# EAGLE design Backplane (EAGLE 7.6.0)
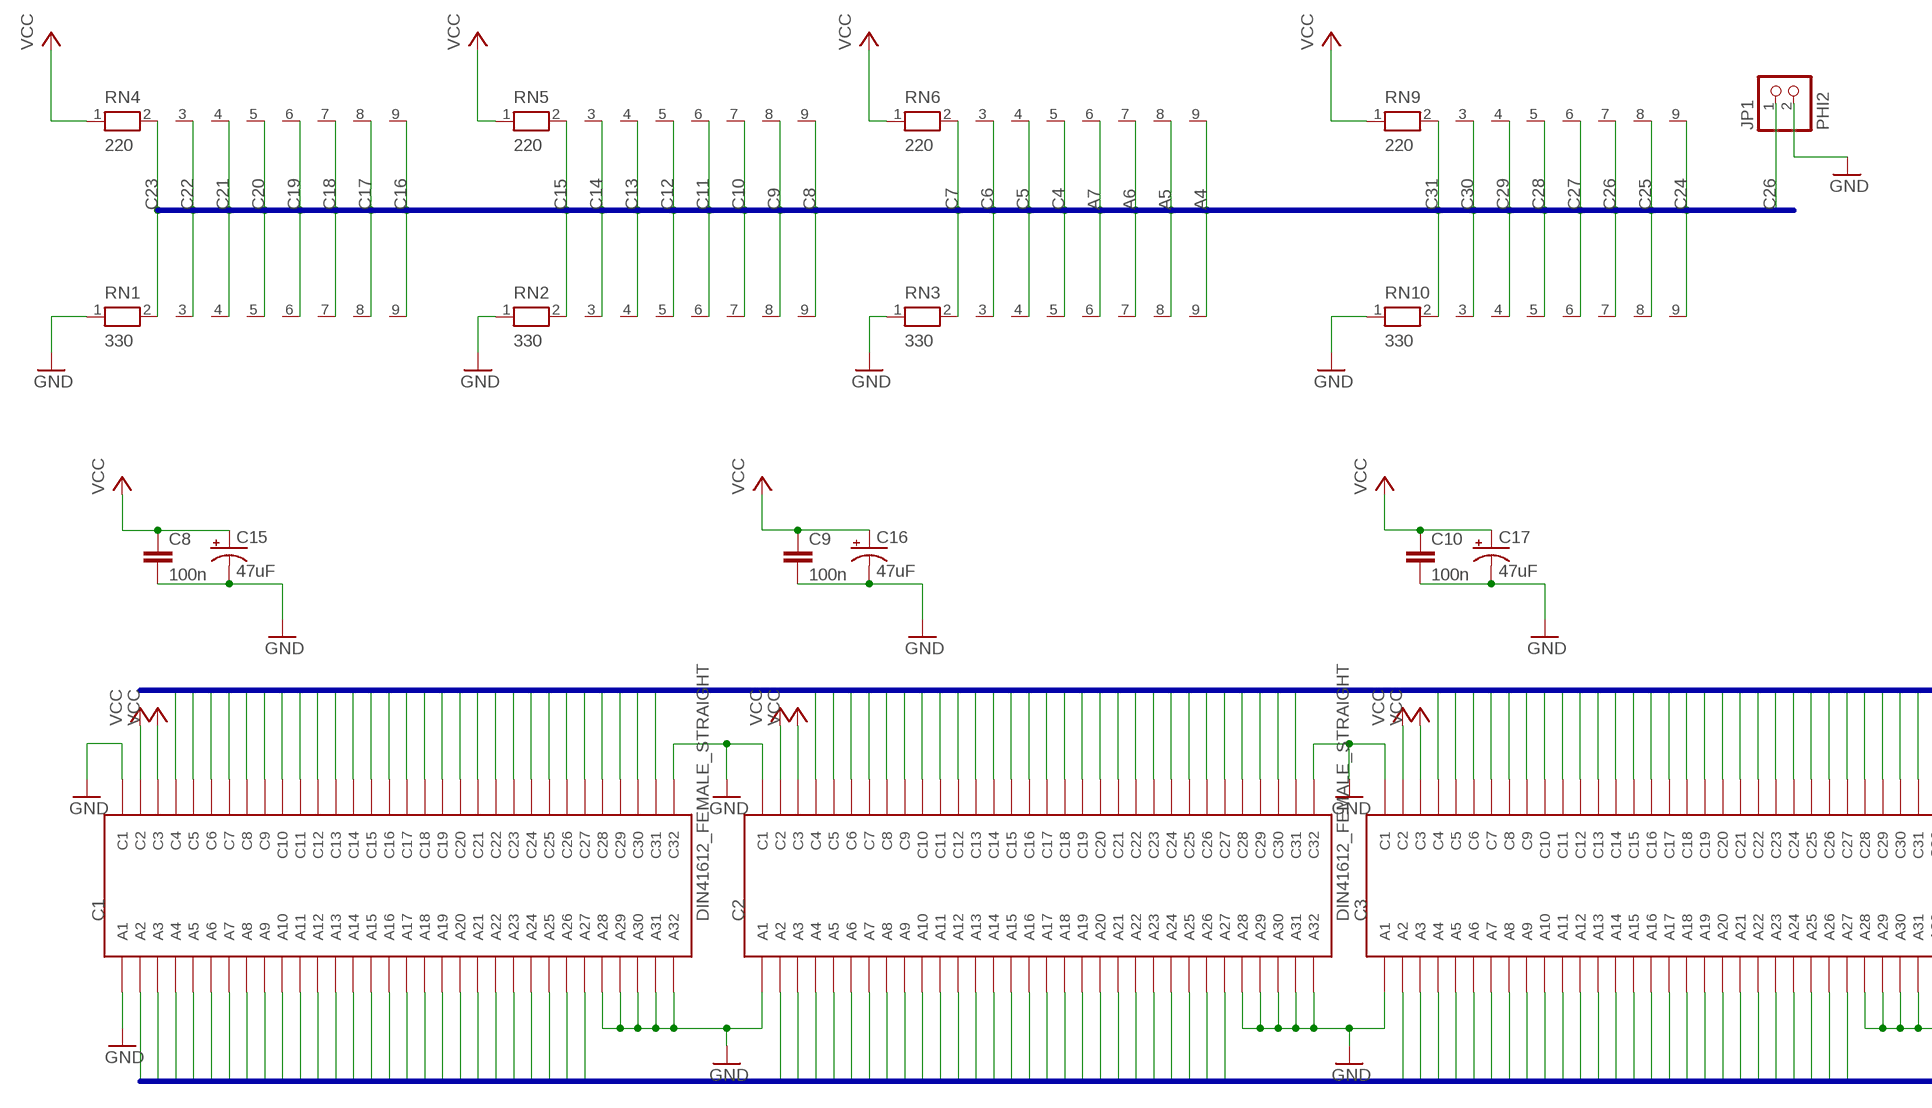
[diagram p0: schematic, sheet 1, part 1 of 2]
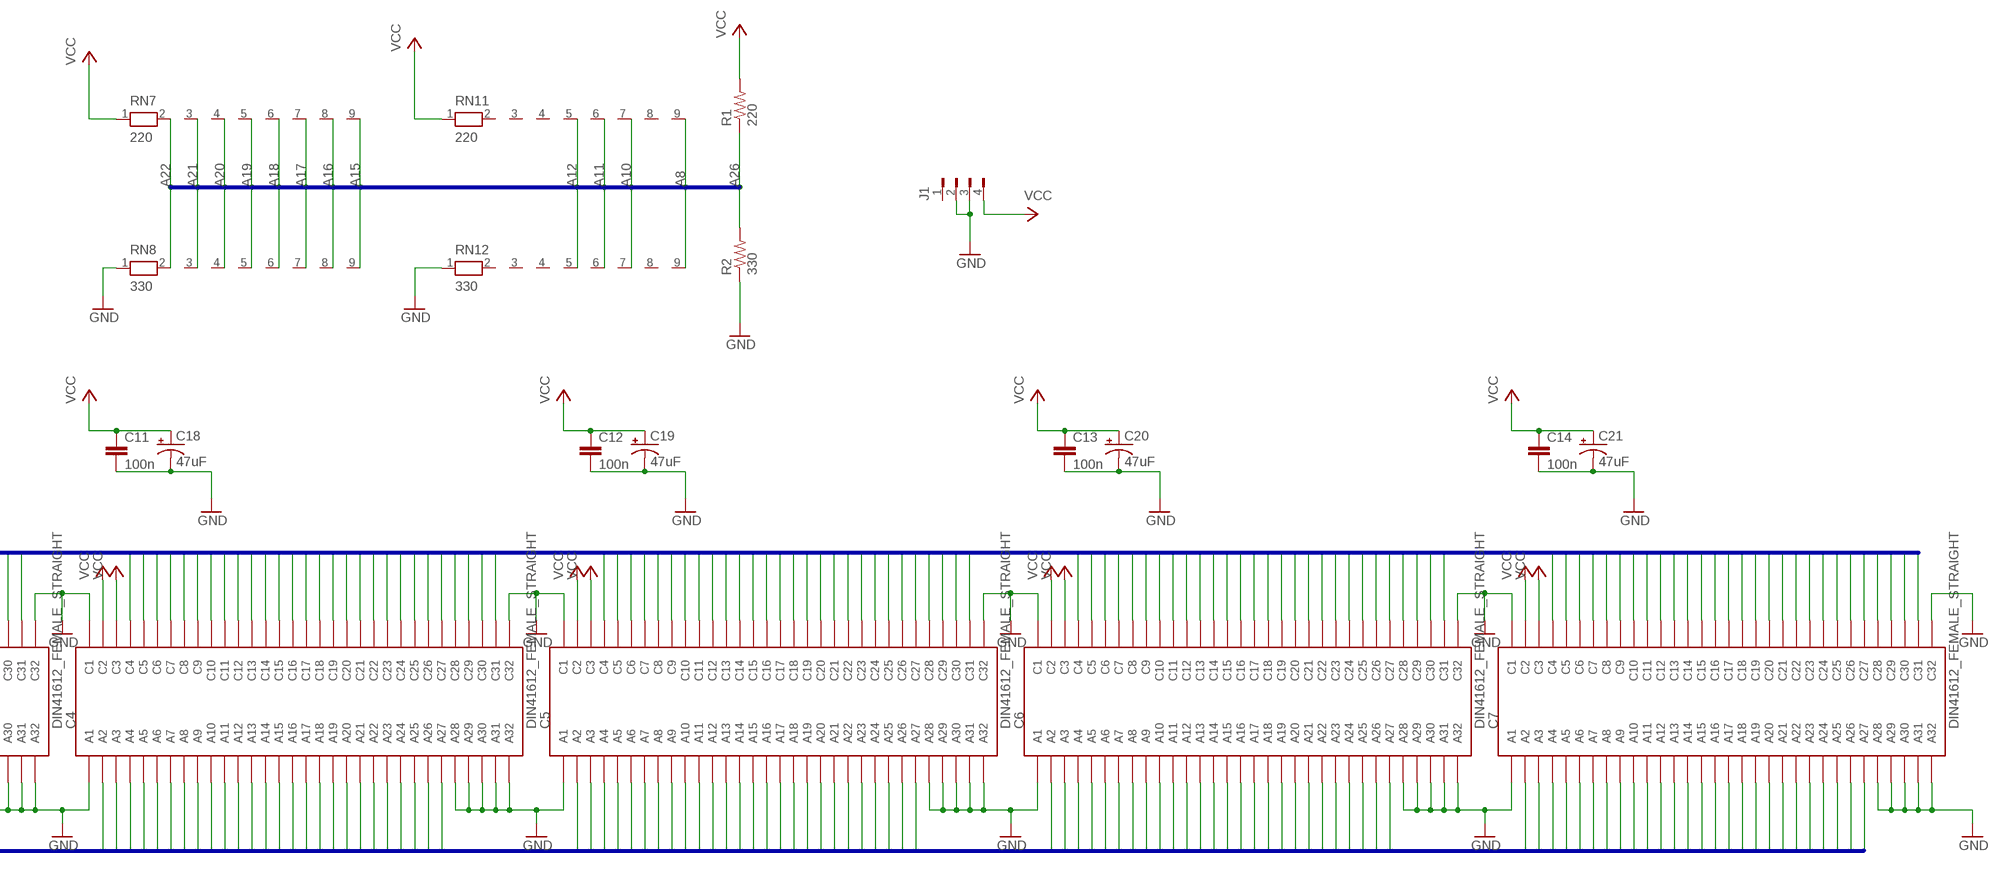
[diagram p1: schematic, sheet 1, part 2 of 2]

## Parts
C1  DIN41612_FEMALE_STRAIGHT  [DIN41612_FEMALE_STRAIGHT]
C2  DIN41612_FEMALE_STRAIGHT  [DIN41612_FEMALE_STRAIGHT]
C3  DIN41612_FEMALE_STRAIGHT  [DIN41612_FEMALE_STRAIGHT]
C4  DIN41612_FEMALE_STRAIGHT  [DIN41612_FEMALE_STRAIGHT]
C5  DIN41612_FEMALE_STRAIGHT  [DIN41612_FEMALE_STRAIGHT]
C6  DIN41612_FEMALE_STRAIGHT  [DIN41612_FEMALE_STRAIGHT]
C7  DIN41612_FEMALE_STRAIGHT  [DIN41612_FEMALE_STRAIGHT]
C8  100n  C-EU025-025X050  [C025-025X050]
C9  100n  C-EU025-025X050  [C025-025X050]
C10  100n  C-EU025-025X050  [C025-025X050]
C11  100n  C-EU025-025X050  [C025-025X050]
C12  100n  C-EU025-025X050  [C025-025X050]
C13  100n  C-EU025-025X050  [C025-025X050]
C14  100n  C-EU025-025X050  [C025-025X050]
C15  47uF  CPOL-USE2.5-7  [E2,5-7]
C16  47uF  CPOL-USE2.5-7  [E2,5-7]
C17  47uF  CPOL-USE2.5-7  [E2,5-7]
C18  47uF  CPOL-USE2.5-7  [E2,5-7]
C19  47uF  CPOL-USE2.5-7  [E2,5-7]
C20  47uF  CPOL-USE2.5-7  [E2,5-7]
C21  47uF  CPOL-USE2.5-7  [E2,5-7]
J1  FLOPPY-4350211  [350211]
JP1  PHI2  PINHD-1X2  [1X02]
R1  220  R-US_0204/5  [0204/5]
R2  330  R-US_0204/5  [0204/5]
RN1  330  RN08  [RN-9]
RN2  330  RN08  [RN-9]
RN3  330  RN08  [RN-9]
RN4  220  RN08  [RN-9]
RN5  220  RN08  [RN-9]
RN6  220  RN08  [RN-9]
RN7  220  RN08  [RN-9]
RN8  330  RN08  [RN-9]
RN9  220  RN08  [RN-9]
RN10  330  RN08  [RN-9]
RN11  220  RN08  [RN-9]
RN12  330  RN08  [RN-9]

## Nets
A2: C1.A2 C2.A2 C3.A2 C4.A2 C5.A2 C6.A2 C7.A2
A3: C1.A3 C2.A3 C3.A3 C4.A3 C5.A3 C6.A3 C7.A3
A4: C1.A4 C2.A4 C3.A4 C4.A4 C5.A4 C6.A4 C7.A4 RN3.9 RN6.9
A5: C1.A5 C2.A5 C3.A5 C4.A5 C5.A5 C6.A5 C7.A5 RN3.8 RN6.8
A6: C1.A6 C2.A6 C3.A6 C4.A6 C5.A6 C6.A6 C7.A6 RN3.7 RN6.7
A7: C1.A7 C2.A7 C3.A7 C4.A7 C5.A7 C6.A7 C7.A7 RN3.6 RN6.6
A8: C1.A8 C2.A8 C3.A8 C4.A8 C5.A8 C6.A8 C7.A8 RN11.9 RN12.9
A9: C1.A9 C2.A9 C3.A9 C4.A9 C5.A9 C6.A9 C7.A9
A10: C1.A10 C2.A10 C3.A10 C4.A10 C5.A10 C6.A10 C7.A10 RN11.7 RN12.7
A11: C1.A11 C2.A11 C3.A11 C4.A11 C5.A11 C6.A11 C7.A11 RN11.6 RN12.6
A12: C1.A12 C2.A12 C3.A12 C4.A12 C5.A12 C6.A12 C7.A12 RN11.5 RN12.5
A13: C1.A13 C2.A13 C3.A13 C4.A13 C5.A13 C6.A13 C7.A13
A14: C1.A14 C2.A14 C3.A14 C4.A14 C5.A14 C6.A14 C7.A14
A15: C1.A15 C2.A15 C3.A15 C4.A15 C5.A15 C6.A15 C7.A15 RN7.9 RN8.9
A16: C1.A16 C2.A16 C3.A16 C4.A16 C5.A16 C6.A16 C7.A16 RN7.8 RN8.8
A17: C1.A17 C2.A17 C3.A17 C4.A17 C5.A17 C6.A17 C7.A17 RN7.7 RN8.7
A18: C1.A18 C2.A18 C3.A18 C4.A18 C5.A18 C6.A18 C7.A18 RN7.6 RN8.6
A19: C1.A19 C2.A19 C3.A19 C4.A19 C5.A19 C6.A19 C7.A19 RN7.5 RN8.5
A20: C1.A20 C2.A20 C3.A20 C4.A20 C5.A20 C6.A20 C7.A20 RN7.4 RN8.4
A21: C1.A21 C2.A21 C3.A21 C4.A21 C5.A21 C6.A21 C7.A21 RN7.3 RN8.3
A22: C1.A22 C2.A22 C3.A22 C4.A22 C5.A22 C6.A22 C7.A22 RN7.2 RN8.2
A23: C1.A23 C2.A23 C3.A23 C4.A23 C5.A23 C6.A23 C7.A23
A24: C1.A24 C2.A24 C3.A24 C4.A24 C5.A24 C6.A24 C7.A24
A25: C1.A25 C2.A25 C3.A25 C4.A25 C5.A25 C6.A25 C7.A25
A26: C1.A26 C2.A26 C3.A26 C4.A26 C5.A26 C6.A26 C7.A26 R1.1 R2.2
A27: C1.A27 C2.A27 C3.A27 C4.A27 C5.A27 C6.A27 C7.A27
C4: C1.C4 C2.C4 C3.C4 C4.C4 C5.C4 C6.C4 C7.C4 RN3.5 RN6.5
C5: C1.C5 C2.C5 C3.C5 C4.C5 C5.C5 C6.C5 C7.C5 RN3.4 RN6.4
C6: C1.C6 C2.C6 C3.C6 C4.C6 C5.C6 C6.C6 C7.C6 RN3.3 RN6.3
C7: C1.C7 C2.C7 C3.C7 C4.C7 C5.C7 C6.C7 C7.C7 RN3.2 RN6.2
C8: C1.C8 C2.C8 C3.C8 C4.C8 C5.C8 C6.C8 C7.C8 RN2.9 RN5.9
C9: C1.C9 C2.C9 C3.C9 C4.C9 C5.C9 C6.C9 C7.C9 RN2.8 RN5.8
C10: C1.C10 C2.C10 C3.C10 C4.C10 C5.C10 C6.C10 C7.C10 RN2.7 RN5.7
C11: C1.C11 C2.C11 C3.C11 C4.C11 C5.C11 C6.C11 C7.C11 RN2.6 RN5.6
C12: C1.C12 C2.C12 C3.C12 C4.C12 C5.C12 C6.C12 C7.C12 RN2.5 RN5.5
C13: C1.C13 C2.C13 C3.C13 C4.C13 C5.C13 C6.C13 C7.C13 RN2.4 RN5.4
C14: C1.C14 C2.C14 C3.C14 C4.C14 C5.C14 C6.C14 C7.C14 RN2.3 RN5.3
C15: C1.C15 C2.C15 C3.C15 C4.C15 C5.C15 C6.C15 C7.C15 RN2.2 RN5.2
C16: C1.C16 C2.C16 C3.C16 C4.C16 C5.C16 C6.C16 C7.C16 RN1.9 RN4.9
C17: C1.C17 C2.C17 C3.C17 C4.C17 C5.C17 C6.C17 C7.C17 RN1.8 RN4.8
C18: C1.C18 C2.C18 C3.C18 C4.C18 C5.C18 C6.C18 C7.C18 RN1.7 RN4.7
C19: C1.C19 C2.C19 C3.C19 C4.C19 C5.C19 C6.C19 C7.C19 RN1.6 RN4.6
C20: C1.C20 C2.C20 C3.C20 C4.C20 C5.C20 C6.C20 C7.C20 RN1.5 RN4.5
C21: C1.C21 C2.C21 C3.C21 C4.C21 C5.C21 C6.C21 C7.C21 RN1.4 RN4.4
C22: C1.C22 C2.C22 C3.C22 C4.C22 C5.C22 C6.C22 C7.C22 RN1.3 RN4.3
C23: C1.C23 C2.C23 C3.C23 C4.C23 C5.C23 C6.C23 C7.C23 RN1.2 RN4.2
C24: C1.C24 C2.C24 C3.C24 C4.C24 C5.C24 C6.C24 C7.C24 RN9.9 RN10.9
C25: C1.C25 C2.C25 C3.C25 C4.C25 C5.C25 C6.C25 C7.C25 RN9.8 RN10.8
C26: C1.C26 C2.C26 C3.C26 C4.C26 C5.C26 C6.C26 C7.C26 JP1.1 RN9.7 RN10.7
C27: C1.C27 C2.C27 C3.C27 C4.C27 C5.C27 C6.C27 C7.C27 RN9.6 RN10.6
C28: C1.C28 C2.C28 C3.C28 C4.C28 C5.C28 C6.C28 C7.C28 RN9.5 RN10.5
C29: C1.C29 C2.C29 C3.C29 C4.C29 C5.C29 C6.C29 C7.C29 RN9.4 RN10.4
C30: C1.C30 C2.C30 C3.C30 C4.C30 C5.C30 C6.C30 C7.C30 RN9.3 RN10.3
C31: C1.C31 C2.C31 C3.C31 C4.C31 C5.C31 C6.C31 C7.C31 RN9.2 RN10.2
GND: C1.A1 C1.A28 C1.A29 C1.A30 C1.A31 C1.A32 C1.C1 C1.C32 C2.A1 C2.A28 C2.A29 C2.A30 C2.A31 C2.A32 C2.C1 C2.C32 C3.A1 C3.A28 C3.A29 C3.A30 C3.A31 C3.A32 C3.C1 C3.C32 C4.A1 C4.A28 C4.A29 C4.A30 C4.A31 C4.A32 C4.C1 C4.C32 C5.A1 C5.A28 C5.A29 C5.A30 C5.A31 C5.A32 C5.C1 C5.C32 C6.A1 C6.A28 C6.A29 C6.A30 C6.A31 C6.A32 C6.C1 C6.C32 C7.A1 C7.A28 C7.A29 C7.A30 C7.A31 C7.A32 C7.C1 C7.C32 C8.2 C9.2 C10.2 C11.2 C12.2 C13.2 C14.2 C15.- C16.- C17.- C18.- C19.- C20.- C21.- J1.2 J1.3 JP1.2 R2.1 RN1.1 RN2.1 RN3.1 RN8.1 RN10.1 RN12.1
VCC: C1.C2 C1.C3 C2.C2 C2.C3 C3.C2 C3.C3 C4.C2 C4.C3 C5.C2 C5.C3 C6.C2 C6.C3 C7.C2 C7.C3 C8.1 C9.1 C10.1 C11.1 C12.1 C13.1 C14.1 C15.+ C16.+ C17.+ C18.+ C19.+ C20.+ C21.+ J1.4 R1.2 RN4.1 RN5.1 RN6.1 RN7.1 RN9.1 RN11.1
Unconnected: J1.1 RN11.2 RN11.3 RN11.4 RN11.8 RN12.2 RN12.3 RN12.4 RN12.8

## Buses
A[1..32]
C[1..32]

## Library data of the parts
C1-C7 = DIN41612:DIN41612_FEMALE_STRAIGHT
C8-C14 = rcl:C-EU: CAPACITOR, European symbol
C15-C21 = rcl:CPOL-US: POLARIZED CAPACITOR, American symbol
J1 = con-amp:FLOPPY-4: MATE N-LOCK Floppy / HDD conector Distributor: Bürklin 71F970
JP1 = pinhead:PINHD-1X2: PIN HEADER
R1 R2 = rcl:R-US_: RESISTOR, American symbol
RN1-RN12 = resistor-net:RN08: RESISTOR NETWORK; OC_FARNELL: unknown; OC_NEWARK: unknown

## Board
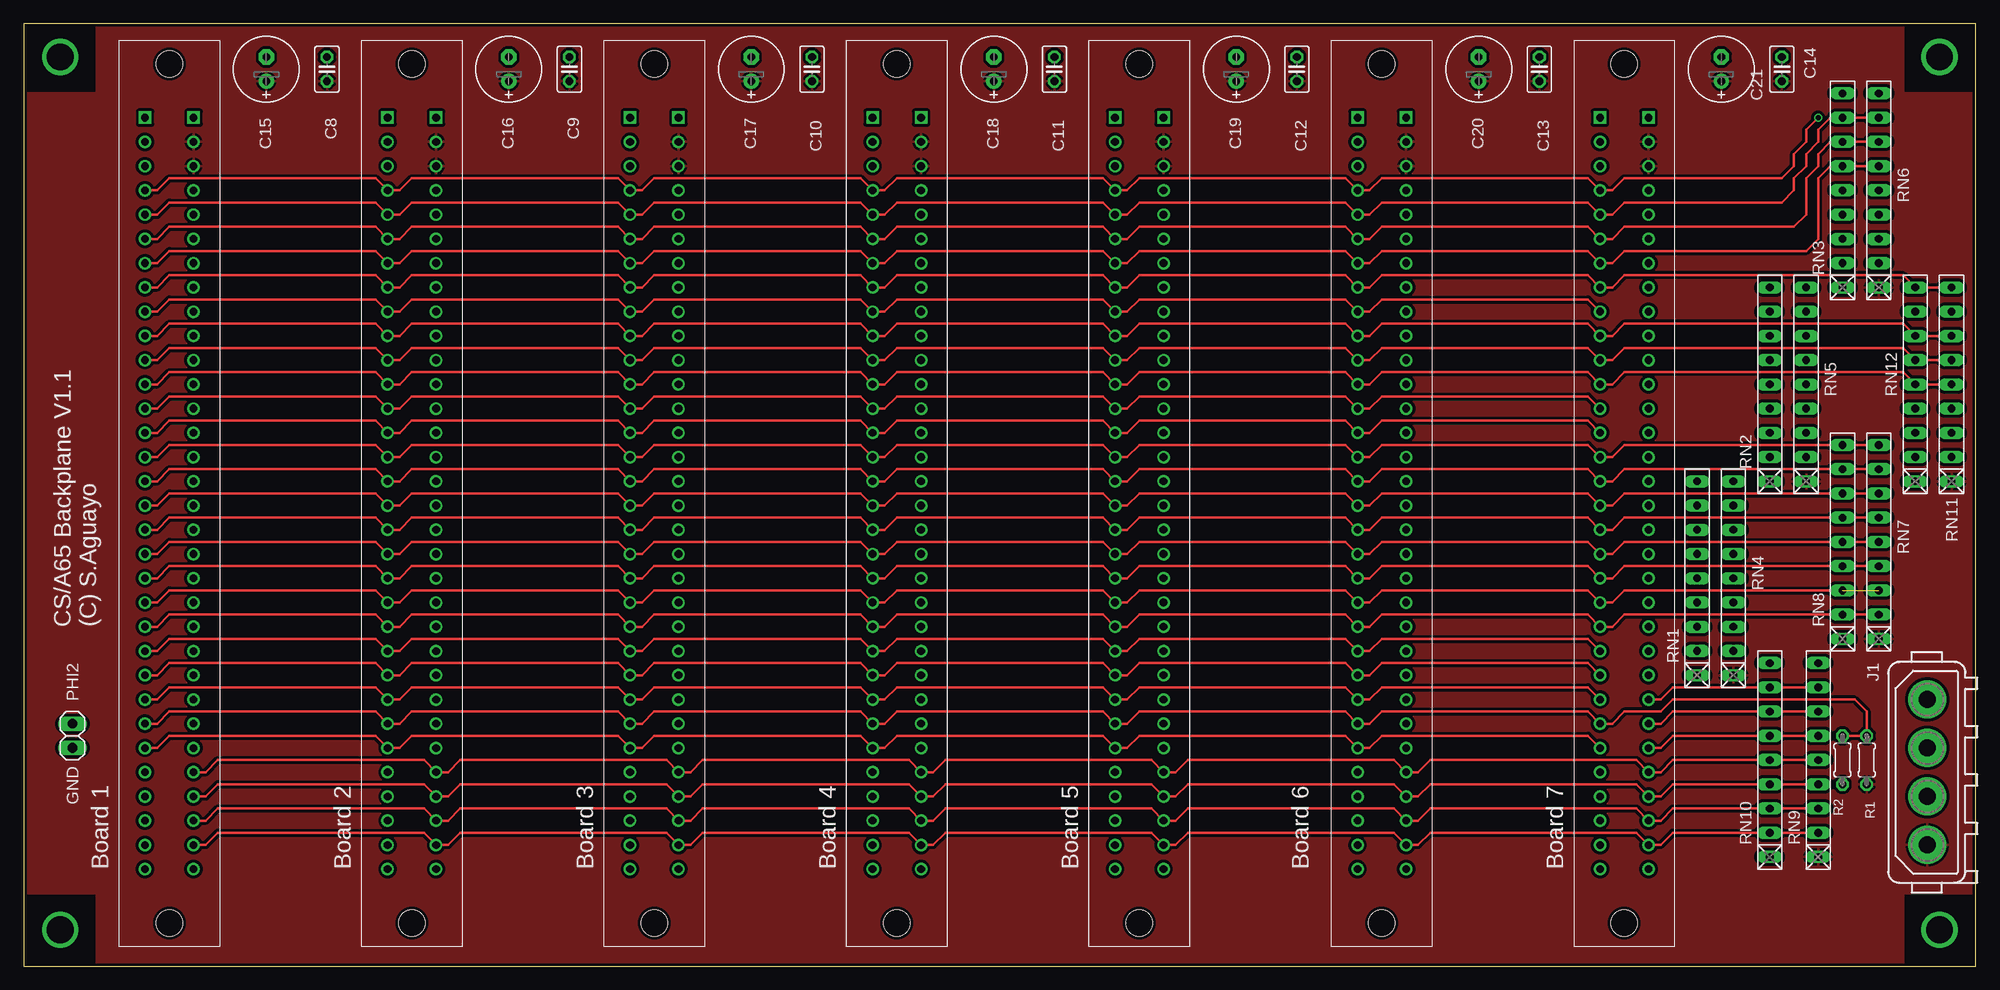
[diagram p2: board, top side]
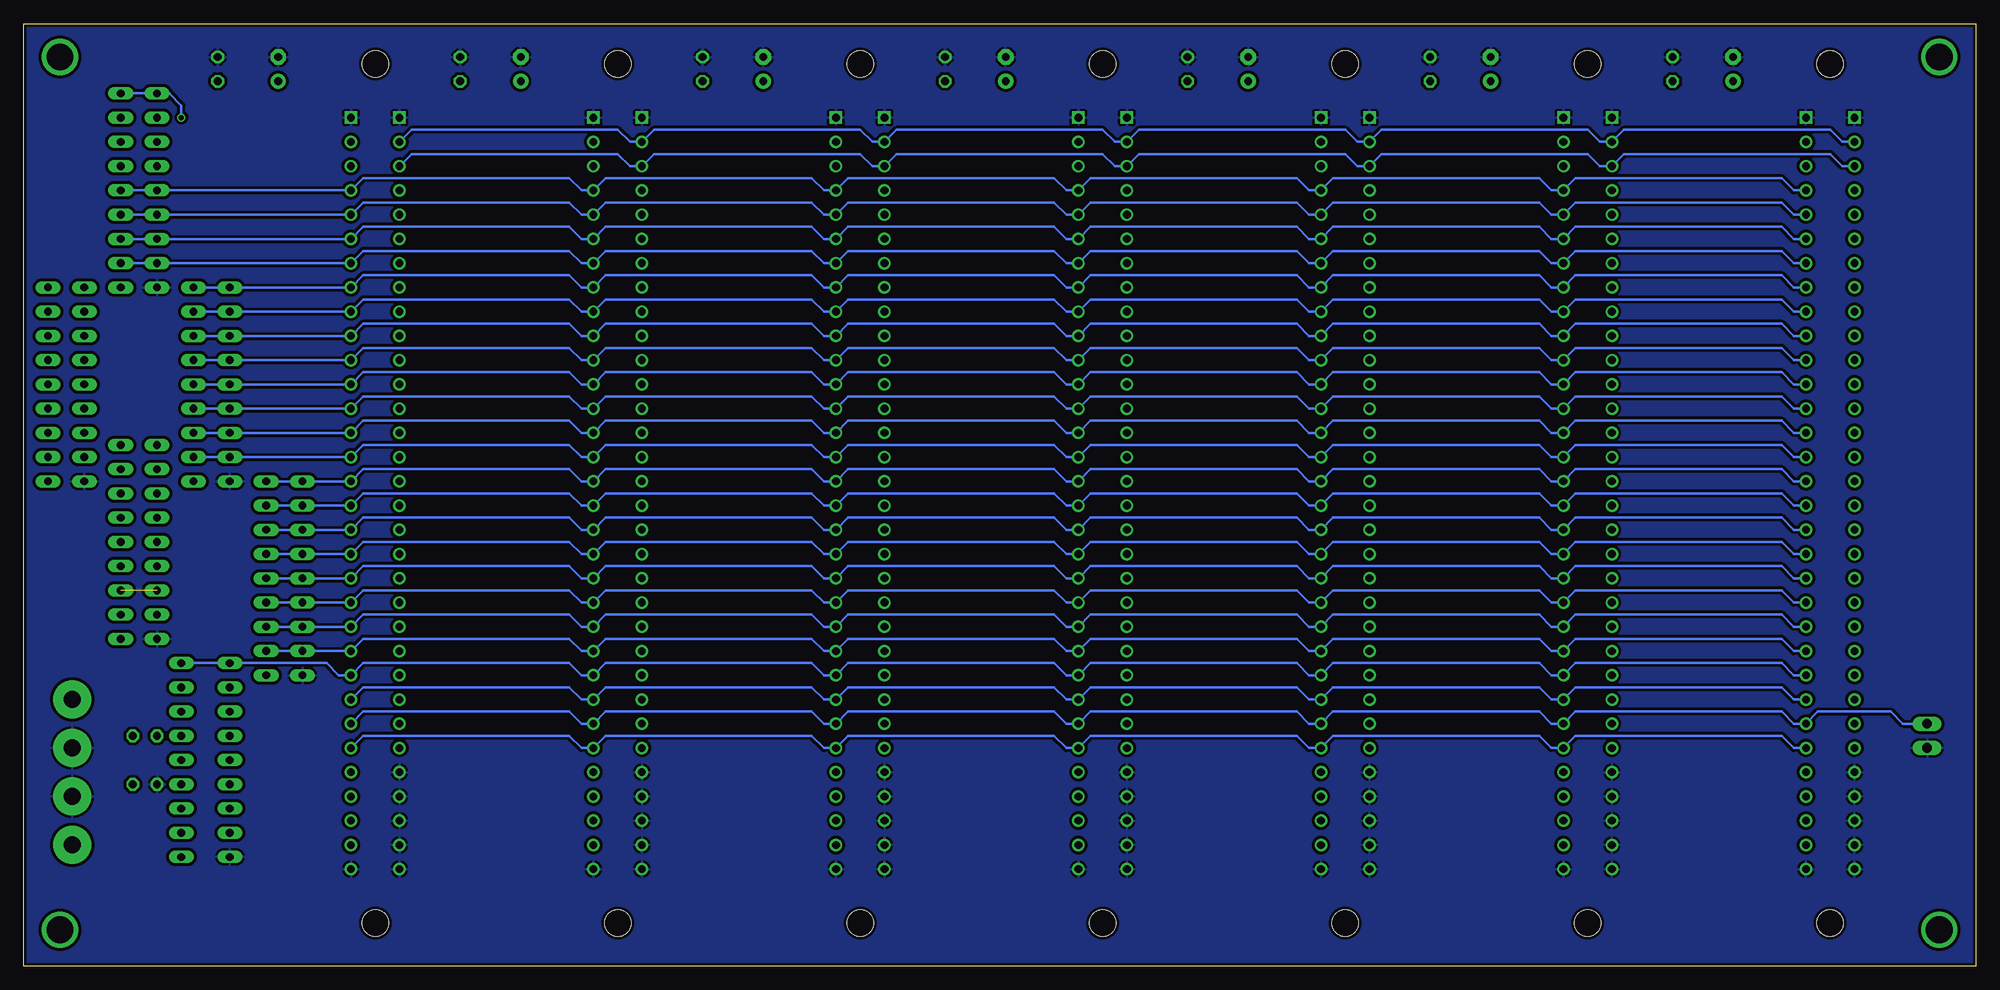
[diagram p3: board, bottom side, seen from below]

Size 204.45 x 98.73 mm. Coordinates in mm from the lower left corner, seen from the top.
Outline: 0,0 204.45,0 204.45,98.73 0,98.73 0,0
Copper layers (1*16): Top 0.035mm / dielectric 1.5mm / Bottom 0.035mm
Design rules "SeeedStudio_2layer_DRU_no_angle_20140221": minimum track width 6mil, minimum drill 12mil, track to track 6mil, track to pad 6mil, pad to pad 6mil, via to via 6mil, smd to smd 0mil, copper to edge 10mil, drill to drill 10mil, minimum pad ring 10mil, minimum via ring 6mil, stop-mask expansion 2mil, vias tented up to drill 100mil, thermal gap 10mil

### Footprints (pad centres in the part's own frame; a part is rotated, then mirrored left to right if it is on the bottom)
DIN41612_FEMALE_STRAIGHT = drill 0.8 square: A1 39.37,2.54; C1 39.37,-2.54 | drill 0.8: A2 36.83,2.54; A3 34.29,2.54; A4 31.75,2.54; A5 29.21,2.54; A6 26.67,2.54; A7 24.13,2.54; A8 21.59,2.54; A9 19.05,2.54; A10 16.51,2.54; A11 13.97,2.54; A12 11.43,2.54; A13 8.89,2.54; A14 6.35,2.54; A15 3.81,2.54; A16 1.27,2.54; A17 -1.27,2.54; A18 -3.81,2.54; A19 -6.35,2.54; A20 -8.89,2.54; A21 -11.43,2.54; A22 -13.97,2.54; A23 -16.51,2.54; A24 -19.05,2.54; A25 -21.59,2.54; A26 -24.13,2.54; A27 -26.67,2.54; A28 -29.21,2.54; A29 -31.75,2.54; A30 -34.29,2.54; A31 -36.83,2.54; A32 -39.37,2.54; C2 36.83,-2.54; C3 34.29,-2.54; C4 31.75,-2.54; C5 29.21,-2.54; C6 26.67,-2.54; C7 24.13,-2.54; C8 21.59,-2.54; C9 19.05,-2.54; C10 16.51,-2.54; C11 13.97,-2.54; C12 11.43,-2.54; C13 8.89,-2.54; C14 6.35,-2.54; C15 3.81,-2.54; C16 1.27,-2.54; C17 -1.27,-2.54; C18 -3.81,-2.54; C19 -6.35,-2.54; C20 -8.89,-2.54; C21 -11.43,-2.54; C22 -13.97,-2.54; C23 -16.51,-2.54; C24 -19.05,-2.54; C25 -21.59,-2.54; C26 -24.13,-2.54; C27 -26.67,-2.54; C28 -29.21,-2.54; C29 -31.75,-2.54; C30 -34.29,-2.54; C31 -36.83,-2.54; C32 -39.37,-2.54 | hole 2.8: -45,0; 45,0
C025-025X050 = drill 0.813 octagon: 1 -1.27,0; 2 1.27,0
E2,5-7 = drill 0.813 pad 1.6: + -1.27,0 | drill 0.813 pad 1.6 octagon: - 1.27,0
350211 = drill 1.8 pad 4: 1 -7.62,0; 2 -2.54,0; 3 2.54,0; 4 7.62,0
1X02 = drill 1.016 long: 1 -1.27,0; 2 1.27,0
0204/5 = drill 0.813 octagon: 1 -2.54,0; 2 2.54,0
RN-9 = drill 0.813 long: 1 -10.16,0; 2 -7.62,0; 3 -5.08,0; 4 -2.54,0; 5 0,0; 6 2.54,0; 7 5.08,0; 8 7.62,0; 9 10.16,0

### Placement (x,y rotation side)
C1  15.24,49.53 90 top
C2  40.64,49.53 90 top
C3  66.04,49.53 90 top
C4  91.44,49.53 90 top
C5  116.84,49.53 90 top
C6  142.24,49.53 90 top
C7  167.64,49.53 90 top
C8  31.75,93.98 90 top
C9  57.15,93.98 90 top
C10  82.55,93.98 90 top
C11  107.95,93.98 90 top
C12  133.35,93.98 90 top
C13  158.75,93.98 90 top
C14  184.15,93.98 90 top
C15  25.4,93.98 90 top
C16  50.8,93.98 90 top
C17  76.2,93.98 90 top
C18  101.6,93.98 90 top
C19  127,93.98 90 top
C20  152.4,93.98 90 top
C21  177.8,93.98 90 top
J1  199.39,20.32 270 top
JP1  5.08,24.13 270 top
R1  193.04,21.59 270 top
R2  190.5,21.59 90 top
RN1  175.26,40.64 90 top
RN2  182.88,60.96 90 top
RN3  190.5,81.28 90 top
RN4  179.07,40.64 90 top
RN5  186.69,60.96 90 top
RN6  194.31,81.28 90 top
RN7  194.31,44.45 90 top
RN8  190.5,44.45 90 top
RN9  187.96,21.59 90 top
RN10  182.88,21.59 90 top
RN11  201.93,60.96 90 top
RN12  198.12,60.96 90 top

### Tracks (layer width: path | path; a pad name or v marks a point on that pad's centre or on a via)
A2
  Bottom 0.254: C1.A2 13.97,86.36 15.24,87.63 36.83,87.63 C2.A2 39.37,86.36 40.64,87.63 62.23,87.63 C3.A2 64.77,86.36 66.04,87.63 87.63,87.63 C4.A2 90.17,86.36 91.44,87.63 113.03,87.63 C5.A2 115.57,86.36 116.84,87.63 138.43,87.63 C6.A2 140.97,86.36 142.24,87.63 163.83,87.63 C7.A2
A3
  Bottom 0.254: C1.A3 13.97,83.82 15.24,85.09 36.83,85.09 C2.A3 39.37,83.82 40.64,85.09 62.23,85.09 C3.A3 64.77,83.82 66.04,85.09 87.63,85.09 C4.A3 90.17,83.82 91.44,85.09 113.03,85.09 C5.A3 115.57,83.82 116.84,85.09 138.43,85.09 C6.A3 140.97,83.82 142.24,85.09 163.83,85.09 C7.A3
A4  (via drill 0.5)
  Top 0.254: C1.A4 13.97,81.28 15.24,82.55 36.83,82.55 C2.A4 39.37,81.28 40.64,82.55 62.23,82.55 C3.A4 64.77,81.28 66.04,82.55 87.63,82.55 C4.A4 90.17,81.28 91.44,82.55 113.03,82.55 C5.A4 115.57,81.28 116.84,82.55 138.43,82.55 C6.A4 140.97,81.28 142.24,82.55 163.83,82.55 C7.A4 166.37,81.28 167.64,82.55 184.15,82.55 185.42,83.82 185.42,85.09 186.69,86.36 186.69,87.63 v187.96,88.9
  Bottom 0.254: v187.96,88.9 187.96,90.17 189.23,91.44 RN3.9 RN6.9
A5
  Top 0.254: C1.A5 13.97,78.74 15.24,80.01 36.83,80.01 C2.A5 39.37,78.74 40.64,80.01 62.23,80.01 C3.A5 64.77,78.74 66.04,80.01 87.63,80.01 C4.A5 90.17,78.74 91.44,80.01 113.03,80.01 C5.A5 115.57,78.74 116.84,80.01 138.43,80.01 C6.A5 140.97,78.74 142.24,80.01 163.83,80.01 C7.A5 166.37,78.74 167.64,80.01 184.15,80.01 185.42,81.28 185.42,82.55 186.69,83.82 186.69,85.09 187.96,86.36 187.96,87.63 189.23,88.9 RN3.8 RN6.8
A6
  Top 0.254: C1.A6 13.97,76.2 15.24,77.47 36.83,77.47 C2.A6 39.37,76.2 40.64,77.47 62.23,77.47 C3.A6 64.77,76.2 66.04,77.47 87.63,77.47 C4.A6 90.17,76.2 91.44,77.47 113.03,77.47 C5.A6 115.57,76.2 116.84,77.47 138.43,77.47 C6.A6 140.97,76.2 142.24,77.47 163.83,77.47 C7.A6 166.37,76.2 167.64,77.47 185.42,77.47 186.69,78.74 186.69,82.55 187.96,83.82 187.96,85.09 189.23,86.36 RN3.7 RN6.7
A7
  Top 0.254: C1.A7 13.97,73.66 15.24,74.93 36.83,74.93 C2.A7 39.37,73.66 40.64,74.93 62.23,74.93 C3.A7 64.77,73.66 66.04,74.93 87.63,74.93 C4.A7 90.17,73.66 91.44,74.93 113.03,74.93 C5.A7 115.57,73.66 116.84,74.93 138.43,74.93 C6.A7 140.97,73.66 142.24,74.93 163.83,74.93 C7.A7 166.37,73.66 167.64,74.93 186.69,74.93 187.96,76.2 187.96,82.55 189.23,83.82 RN3.6 RN6.6
A8
  Top 0.254: C1.A8 13.97,71.12 15.24,72.39 36.83,72.39 C2.A8 39.37,71.12 40.64,72.39 62.23,72.39 C3.A8 64.77,71.12 66.04,72.39 87.63,72.39 C4.A8 90.17,71.12 91.44,72.39 113.03,72.39 C5.A8 115.57,71.12 116.84,72.39 138.43,72.39 C6.A8 140.97,71.12 142.24,72.39 163.83,72.39 C7.A8 166.37,71.12 167.64,72.39 196.85,72.39 RN12.9 RN11.9
A9
  Top 0.254: C1.A9 13.97,68.58 15.24,69.85 36.83,69.85 C2.A9 39.37,68.58 40.64,69.85 62.23,69.85 C3.A9 64.77,68.58 66.04,69.85 87.63,69.85 C4.A9 90.17,68.58 91.44,69.85 113.03,69.85 C5.A9 115.57,68.58 116.84,69.85 138.43,69.85 C6.A9 140.97,68.58 142.24,69.85 163.83,69.85 C7.A9
A10
  Top 0.254: C1.A10 13.97,66.04 15.24,67.31 36.83,67.31 C2.A10 39.37,66.04 40.64,67.31 62.23,67.31 C3.A10 64.77,66.04 66.04,67.31 87.63,67.31 C4.A10 90.17,66.04 91.44,67.31 113.03,67.31 C5.A10 115.57,66.04 116.84,67.31 138.43,67.31 C6.A10 140.97,66.04 142.24,67.31 163.83,67.31 C7.A10 166.37,66.04 167.64,67.31 196.85,67.31 RN12.7 RN11.7
A11
  Top 0.254: C1.A11 13.97,63.5 15.24,64.77 36.83,64.77 C2.A11 39.37,63.5 40.64,64.77 62.23,64.77 C3.A11 64.77,63.5 66.04,64.77 87.63,64.77 C4.A11 90.17,63.5 91.44,64.77 113.03,64.77 C5.A11 115.57,63.5 116.84,64.77 138.43,64.77 C6.A11 140.97,63.5 142.24,64.77 163.83,64.77 C7.A11 166.37,63.5 167.64,64.77 196.85,64.77 RN12.6 RN11.6
A12
  Top 0.254: C1.A12 13.97,60.96 15.24,62.23 36.83,62.23 C2.A12 39.37,60.96 40.64,62.23 62.23,62.23 C3.A12 64.77,60.96 66.04,62.23 87.63,62.23 C4.A12 90.17,60.96 91.44,62.23 113.03,62.23 C5.A12 115.57,60.96 116.84,62.23 138.43,62.23 C6.A12 140.97,60.96 142.24,62.23 163.83,62.23 C7.A12 166.37,60.96 167.64,62.23 196.85,62.23 RN12.5 RN11.5
A13
  Top 0.254: C1.A13 13.97,58.42 15.24,59.69 36.83,59.69 C2.A13 39.37,58.42 40.64,59.69 62.23,59.69 C3.A13 64.77,58.42 66.04,59.69 87.63,59.69 C4.A13 90.17,58.42 91.44,59.69 113.03,59.69 C5.A13 115.57,58.42 116.84,59.69 138.43,59.69 C6.A13 140.97,58.42 142.24,59.69 163.83,59.69 C7.A13
A14
  Top 0.254: C1.A14 13.97,55.88 15.24,57.15 36.83,57.15 C2.A14 39.37,55.88 40.64,57.15 62.23,57.15 C3.A14 64.77,55.88 66.04,57.15 87.63,57.15 C4.A14 90.17,55.88 91.44,57.15 113.03,57.15 C5.A14 115.57,55.88 116.84,57.15 138.43,57.15 C6.A14 140.97,55.88 142.24,57.15 163.83,57.15 C7.A14
A15
  Top 0.254: C1.A15 13.97,53.34 15.24,54.61 36.83,54.61 C2.A15 39.37,53.34 40.64,54.61 62.23,54.61 C3.A15 64.77,53.34 66.04,54.61 87.63,54.61 C4.A15 90.17,53.34 91.44,54.61 113.03,54.61 C5.A15 115.57,53.34 116.84,54.61 138.43,54.61 C6.A15 140.97,53.34 142.24,54.61 163.83,54.61 C7.A15 166.37,53.34 167.64,54.61 RN8.9 RN7.9
A16
  Top 0.254: C1.A16 13.97,50.8 15.24,52.07 36.83,52.07 C2.A16 39.37,50.8 40.64,52.07 62.23,52.07 C3.A16 64.77,50.8 66.04,52.07 87.63,52.07 C4.A16 90.17,50.8 91.44,52.07 113.03,52.07 C5.A16 115.57,50.8 116.84,52.07 138.43,52.07 C6.A16 140.97,50.8 142.24,52.07 163.83,52.07 C7.A16 166.37,50.8 167.64,52.07 RN8.8 RN7.8
A17
  Top 0.254: C1.A17 13.97,48.26 15.24,49.53 36.83,49.53 C2.A17 39.37,48.26 40.64,49.53 62.23,49.53 C3.A17 64.77,48.26 66.04,49.53 87.63,49.53 C4.A17 90.17,48.26 91.44,49.53 113.03,49.53 C5.A17 115.57,48.26 116.84,49.53 138.43,49.53 C6.A17 140.97,48.26 142.24,49.53 163.83,49.53 C7.A17 166.37,48.26 167.64,49.53 RN8.7 RN7.7
A18
  Top 0.254: C1.A18 13.97,45.72 15.24,46.99 36.83,46.99 C2.A18 39.37,45.72 40.64,46.99 62.23,46.99 C3.A18 64.77,45.72 66.04,46.99 87.63,46.99 C4.A18 90.17,45.72 91.44,46.99 113.03,46.99 C5.A18 115.57,45.72 116.84,46.99 138.43,46.99 C6.A18 140.97,45.72 142.24,46.99 163.83,46.99 C7.A18 166.37,45.72 167.64,46.99 RN8.6 RN7.6
A19
  Top 0.254: C1.A19 13.97,43.18 15.24,44.45 36.83,44.45 C2.A19 39.37,43.18 40.64,44.45 62.23,44.45 C3.A19 64.77,43.18 66.04,44.45 87.63,44.45 C4.A19 90.17,43.18 91.44,44.45 113.03,44.45 C5.A19 115.57,43.18 116.84,44.45 138.43,44.45 C6.A19 140.97,43.18 142.24,44.45 163.83,44.45 C7.A19 166.37,43.18 167.64,44.45 RN8.5 RN7.5
A20
  Top 0.254: C1.A20 13.97,40.64 15.24,41.91 36.83,41.91 C2.A20 39.37,40.64 40.64,41.91 62.23,41.91 C3.A20 64.77,40.64 66.04,41.91 87.63,41.91 C4.A20 90.17,40.64 91.44,41.91 113.03,41.91 C5.A20 115.57,40.64 116.84,41.91 138.43,41.91 C6.A20 140.97,40.64 142.24,41.91 163.83,41.91 C7.A20 166.37,40.64 167.64,41.91 RN8.4 RN7.4
A21  (1 unrouted)
  Top 0.254: C1.A21 13.97,38.1 15.24,39.37 36.83,39.37 C2.A21 39.37,38.1 40.64,39.37 62.23,39.37 C3.A21 64.77,38.1 66.04,39.37 87.63,39.37 C4.A21 90.17,38.1 91.44,39.37 113.03,39.37 C5.A21 115.57,38.1 116.84,39.37 138.43,39.37 C6.A21 140.97,38.1 142.24,39.37 163.83,39.37 C7.A21 166.37,38.1 167.64,39.37 RN8.3
A22
  Top 0.254: C1.A22 13.97,35.56 15.24,36.83 36.83,36.83 C2.A22 39.37,35.56 40.64,36.83 62.23,36.83 C3.A22 64.77,35.56 66.04,36.83 87.63,36.83 C4.A22 90.17,35.56 91.44,36.83 113.03,36.83 C5.A22 115.57,35.56 116.84,36.83 138.43,36.83 C6.A22 140.97,35.56 142.24,36.83 163.83,36.83 C7.A22 166.37,35.56 167.64,36.83 RN8.2 RN7.2
A23
  Top 0.254: C1.A23 13.97,33.02 15.24,34.29 36.83,34.29 C2.A23 39.37,33.02 40.64,34.29 62.23,34.29 C3.A23 64.77,33.02 66.04,34.29 87.63,34.29 C4.A23 90.17,33.02 91.44,34.29 113.03,34.29 C5.A23 115.57,33.02 116.84,34.29 138.43,34.29 C6.A23 140.97,33.02 142.24,34.29 163.83,34.29 C7.A23
A24
  Top 0.254: C1.A24 13.97,30.48 15.24,31.75 36.83,31.75 C2.A24 39.37,30.48 40.64,31.75 62.23,31.75 C3.A24 64.77,30.48 66.04,31.75 87.63,31.75 C4.A24 90.17,30.48 91.44,31.75 113.03,31.75 C5.A24 115.57,30.48 116.84,31.75 138.43,31.75 C6.A24 140.97,30.48 142.24,31.75 163.83,31.75 C7.A24
A25
  Top 0.254: C1.A25 13.97,27.94 15.24,29.21 36.83,29.21 C2.A25 39.37,27.94 40.64,29.21 62.23,29.21 C3.A25 64.77,27.94 66.04,29.21 87.63,29.21 C4.A25 90.17,27.94 91.44,29.21 113.03,29.21 C5.A25 115.57,27.94 116.84,29.21 138.43,29.21 C6.A25 140.97,27.94 142.24,29.21 163.83,29.21 C7.A25
A26
  Top 0.254: C1.A26 13.97,25.4 15.24,26.67 36.83,26.67 C2.A26 39.37,25.4 40.64,26.67 62.23,26.67 C3.A26 64.77,25.4 66.04,26.67 87.63,26.67 C4.A26 90.17,25.4 91.44,26.67 113.03,26.67 C5.A26 115.57,25.4 116.84,26.67 138.43,26.67 C6.A26 140.97,25.4 142.24,26.67 163.83,26.67 C7.A26 166.37,25.4 167.64,26.67 171.45,26.67 172.72,27.94 191.77,27.94 193.04,26.67 R1.1 R2.2
A27
  Top 0.254: C1.A27 13.97,22.86 15.24,24.13 36.83,24.13 C2.A27 39.37,22.86 40.64,24.13 62.23,24.13 C3.A27 64.77,22.86 66.04,24.13 87.63,24.13 C4.A27 90.17,22.86 91.44,24.13 113.03,24.13 C5.A27 115.57,22.86 116.84,24.13 138.43,24.13 C6.A27 140.97,22.86 142.24,24.13 163.83,24.13 C7.A27
C4
  Bottom 0.254: C1.C4 19.05,81.28 20.32,82.55 41.91,82.55 C2.C4 44.45,81.28 45.72,82.55 67.31,82.55 C3.C4 69.85,81.28 71.12,82.55 92.71,82.55 C4.C4 95.25,81.28 96.52,82.55 118.11,82.55 C5.C4 120.65,81.28 121.92,82.55 143.51,82.55 C6.C4 146.05,81.28 147.32,82.55 168.91,82.55 C7.C4 RN3.5 RN6.5
C5
  Bottom 0.254: C1.C5 19.05,78.74 20.32,80.01 41.91,80.01 C2.C5 44.45,78.74 45.72,80.01 67.31,80.01 C3.C5 69.85,78.74 71.12,80.01 92.71,80.01 C4.C5 95.25,78.74 96.52,80.01 118.11,80.01 C5.C5 120.65,78.74 121.92,80.01 143.51,80.01 C6.C5 146.05,78.74 147.32,80.01 168.91,80.01 C7.C5 RN3.4 RN6.4
C6
  Bottom 0.254: C1.C6 19.05,76.2 20.32,77.47 41.91,77.47 C2.C6 44.45,76.2 45.72,77.47 67.31,77.47 C3.C6 69.85,76.2 71.12,77.47 92.71,77.47 C4.C6 95.25,76.2 96.52,77.47 118.11,77.47 C5.C6 120.65,76.2 121.92,77.47 143.51,77.47 C6.C6 146.05,76.2 147.32,77.47 168.91,77.47 C7.C6 RN3.3 RN6.3
C7
  Bottom 0.254: C1.C7 19.05,73.66 20.32,74.93 41.91,74.93 C2.C7 44.45,73.66 45.72,74.93 67.31,74.93 C3.C7 69.85,73.66 71.12,74.93 92.71,74.93 C4.C7 95.25,73.66 96.52,74.93 118.11,74.93 C5.C7 120.65,73.66 121.92,74.93 143.51,74.93 C6.C7 146.05,73.66 147.32,74.93 168.91,74.93 C7.C7 RN3.2 RN6.2
C8
  Bottom 0.254: C1.C8 19.05,71.12 20.32,72.39 41.91,72.39 C2.C8 44.45,71.12 45.72,72.39 67.31,72.39 C3.C8 69.85,71.12 71.12,72.39 92.71,72.39 C4.C8 95.25,71.12 96.52,72.39 118.11,72.39 C5.C8 120.65,71.12 121.92,72.39 143.51,72.39 C6.C8 146.05,71.12 147.32,72.39 168.91,72.39 C7.C8 RN2.9 RN5.9
C9
  Bottom 0.254: C1.C9 19.05,68.58 20.32,69.85 41.91,69.85 C2.C9 44.45,68.58 45.72,69.85 67.31,69.85 C3.C9 69.85,68.58 71.12,69.85 92.71,69.85 C4.C9 95.25,68.58 96.52,69.85 118.11,69.85 C5.C9 120.65,68.58 121.92,69.85 143.51,69.85 C6.C9 146.05,68.58 147.32,69.85 168.91,69.85 C7.C9 RN2.8 RN5.8
C10
  Bottom 0.254: C1.C10 19.05,66.04 20.32,67.31 41.91,67.31 C2.C10 44.45,66.04 45.72,67.31 67.31,67.31 C3.C10 69.85,66.04 71.12,67.31 92.71,67.31 C4.C10 95.25,66.04 96.52,67.31 118.11,67.31 C5.C10 120.65,66.04 121.92,67.31 143.51,67.31 C6.C10 146.05,66.04 147.32,67.31 168.91,67.31 C7.C10 RN2.7 RN5.7
C11
  Bottom 0.254: C1.C11 19.05,63.5 20.32,64.77 41.91,64.77 C2.C11 44.45,63.5 45.72,64.77 67.31,64.77 C3.C11 69.85,63.5 71.12,64.77 92.71,64.77 C4.C11 95.25,63.5 96.52,64.77 118.11,64.77 C5.C11 120.65,63.5 121.92,64.77 143.51,64.77 C6.C11 146.05,63.5 147.32,64.77 168.91,64.77 C7.C11 RN2.6 RN5.6
C12
  Bottom 0.254: C1.C12 19.05,60.96 20.32,62.23 41.91,62.23 C2.C12 44.45,60.96 45.72,62.23 67.31,62.23 C3.C12 69.85,60.96 71.12,62.23 92.71,62.23 C4.C12 95.25,60.96 96.52,62.23 118.11,62.23 C5.C12 120.65,60.96 121.92,62.23 143.51,62.23 C6.C12 146.05,60.96 147.32,62.23 168.91,62.23 C7.C12 RN2.5 RN5.5
C13
  Bottom 0.254: C1.C13 19.05,58.42 20.32,59.69 41.91,59.69 C2.C13 44.45,58.42 45.72,59.69 67.31,59.69 C3.C13 69.85,58.42 71.12,59.69 92.71,59.69 C4.C13 95.25,58.42 96.52,59.69 118.11,59.69 C5.C13 120.65,58.42 121.92,59.69 143.51,59.69 C6.C13 146.05,58.42 147.32,59.69 168.91,59.69 C7.C13 RN2.4 RN5.4
C14
  Bottom 0.254: C1.C14 19.05,55.88 20.32,57.15 41.91,57.15 C2.C14 44.45,55.88 45.72,57.15 67.31,57.15 C3.C14 69.85,55.88 71.12,57.15 92.71,57.15 C4.C14 95.25,55.88 96.52,57.15 118.11,57.15 C5.C14 120.65,55.88 121.92,57.15 143.51,57.15 C6.C14 146.05,55.88 147.32,57.15 168.91,57.15 C7.C14 RN2.3 RN5.3
C15
  Bottom 0.254: C1.C15 19.05,53.34 20.32,54.61 41.91,54.61 C2.C15 44.45,53.34 45.72,54.61 67.31,54.61 C3.C15 69.85,53.34 71.12,54.61 92.71,54.61 C4.C15 95.25,53.34 96.52,54.61 118.11,54.61 C5.C15 120.65,53.34 121.92,54.61 143.51,54.61 C6.C15 146.05,53.34 147.32,54.61 168.91,54.61 C7.C15 RN2.2 RN5.2
C16
  Bottom 0.254: C1.C16 19.05,50.8 20.32,52.07 41.91,52.07 C2.C16 44.45,50.8 45.72,52.07 67.31,52.07 C3.C16 69.85,50.8 71.12,52.07 92.71,52.07 C4.C16 95.25,50.8 96.52,52.07 118.11,52.07 C5.C16 120.65,50.8 121.92,52.07 143.51,52.07 C6.C16 146.05,50.8 147.32,52.07 168.91,52.07 C7.C16 RN1.9 RN4.9
C17
  Bottom 0.254: C1.C17 19.05,48.26 20.32,49.53 41.91,49.53 C2.C17 44.45,48.26 45.72,49.53 67.31,49.53 C3.C17 69.85,48.26 71.12,49.53 92.71,49.53 C4.C17 95.25,48.26 96.52,49.53 118.11,49.53 C5.C17 120.65,48.26 121.92,49.53 143.51,49.53 C6.C17 146.05,48.26 147.32,49.53 168.91,49.53 C7.C17 RN1.8 RN4.8
C18
  Bottom 0.254: C1.C18 19.05,45.72 20.32,46.99 41.91,46.99 C2.C18 44.45,45.72 45.72,46.99 67.31,46.99 C3.C18 69.85,45.72 71.12,46.99 92.71,46.99 C4.C18 95.25,45.72 96.52,46.99 118.11,46.99 C5.C18 120.65,45.72 121.92,46.99 143.51,46.99 C6.C18 146.05,45.72 147.32,46.99 168.91,46.99 C7.C18 RN1.7 RN4.7
C19
  Bottom 0.254: C1.C19 19.05,43.18 20.32,44.45 41.91,44.45 C2.C19 44.45,43.18 45.72,44.45 67.31,44.45 C3.C19 69.85,43.18 71.12,44.45 92.71,44.45 C4.C19 95.25,43.18 96.52,44.45 118.11,44.45 C5.C19 120.65,43.18 121.92,44.45 143.51,44.45 C6.C19 146.05,43.18 147.32,44.45 168.91,44.45 C7.C19 RN1.6 RN4.6
C20
  Bottom 0.254: C1.C20 19.05,40.64 20.32,41.91 41.91,41.91 C2.C20 44.45,40.64 45.72,41.91 67.31,41.91 C3.C20 69.85,40.64 71.12,41.91 92.71,41.91 C4.C20 95.25,40.64 96.52,41.91 118.11,41.91 C5.C20 120.65,40.64 121.92,41.91 143.51,41.91 C6.C20 146.05,40.64 147.32,41.91 168.91,41.91 C7.C20 RN1.5 RN4.5
C21
  Bottom 0.254: C1.C21 19.05,38.1 20.32,39.37 41.91,39.37 C2.C21 44.45,38.1 45.72,39.37 67.31,39.37 C3.C21 69.85,38.1 71.12,39.37 92.71,39.37 C4.C21 95.25,38.1 96.52,39.37 118.11,39.37 C5.C21 120.65,38.1 121.92,39.37 143.51,39.37 C6.C21 146.05,38.1 147.32,39.37 168.91,39.37 C7.C21 RN1.4 RN4.4
C22
  Bottom 0.254: C1.C22 19.05,35.56 20.32,36.83 41.91,36.83 C2.C22 44.45,35.56 45.72,36.83 67.31,36.83 C3.C22 69.85,35.56 71.12,36.83 92.71,36.83 C4.C22 95.25,35.56 96.52,36.83 118.11,36.83 C5.C22 120.65,35.56 121.92,36.83 143.51,36.83 C6.C22 146.05,35.56 147.32,36.83 168.91,36.83 C7.C22 RN1.3 RN4.3
C23
  Bottom 0.254: C1.C23 19.05,33.02 20.32,34.29 41.91,34.29 C2.C23 44.45,33.02 45.72,34.29 67.31,34.29 C3.C23 69.85,33.02 71.12,34.29 92.71,34.29 C4.C23 95.25,33.02 96.52,34.29 118.11,34.29 C5.C23 120.65,33.02 121.92,34.29 143.51,34.29 C6.C23 146.05,33.02 147.32,34.29 168.91,34.29 C7.C23 RN1.2 RN4.2
C24
  Bottom 0.254: C1.C24 19.05,30.48 20.32,31.75 41.91,31.75 C2.C24 44.45,30.48 45.72,31.75 67.31,31.75 C3.C24 69.85,30.48 71.12,31.75 92.71,31.75 C4.C24 95.25,30.48 96.52,31.75 118.11,31.75 C5.C24 120.65,30.48 121.92,31.75 143.51,31.75 C6.C24 146.05,30.48 147.32,31.75 168.91,31.75 C7.C24 171.45,30.48 172.72,31.75 RN10.9 RN9.9
C25
  Top 0.254: C7.C25 171.45,27.94 172.72,29.21 RN10.8 RN9.8
  Bottom 0.254: C1.C25 19.05,27.94 20.32,29.21 41.91,29.21 C2.C25 44.45,27.94 45.72,29.21 67.31,29.21 C3.C25 69.85,27.94 71.12,29.21 92.71,29.21 C4.C25 95.25,27.94 96.52,29.21 118.11,29.21 C5.C25 120.65,27.94 121.92,29.21 143.51,29.21 C6.C25 146.05,27.94 147.32,29.21 168.91,29.21 C7.C25
C26
  Top 0.254: C7.C26 171.45,25.4 172.72,26.67 RN10.7 RN9.7
  Bottom 0.254: C7.C26 168.91,26.67 147.32,26.67 146.05,25.4 C6.C26 143.51,26.67 121.92,26.67 120.65,25.4 C5.C26 118.11,26.67 96.52,26.67 95.25,25.4 C4.C26 92.71,26.67 71.12,26.67 69.85,25.4 C3.C26 67.31,26.67 45.72,26.67 44.45,25.4 C2.C26 41.91,26.67 20.32,26.67 19.05,25.4 C1.C26 16.51,26.67 8.89,26.67 7.62,25.4 JP1.1
C27
  Top 0.254: C7.C27 171.45,22.86 172.72,24.13 RN10.6 RN9.6
  Bottom 0.254: C1.C27 19.05,22.86 20.32,24.13 41.91,24.13 C2.C27 44.45,22.86 45.72,24.13 67.31,24.13 C3.C27 69.85,22.86 71.12,24.13 92.71,24.13 C4.C27 95.25,22.86 96.52,24.13 118.11,24.13 C5.C27 120.65,22.86 121.92,24.13 143.51,24.13 C6.C27 146.05,22.86 147.32,24.13 168.91,24.13 C7.C27
C28
  Top 0.254: C1.C28 19.05,20.32 20.32,21.59 41.91,21.59 C2.C28 44.45,20.32 45.72,21.59 67.31,21.59 C3.C28 69.85,20.32 71.12,21.59 92.71,21.59 C4.C28 95.25,20.32 96.52,21.59 118.11,21.59 C5.C28 120.65,20.32 121.92,21.59 143.51,21.59 C6.C28 146.05,20.32 147.32,21.59 168.91,21.59 C7.C28 171.45,20.32 172.72,21.59 RN10.5 RN9.5
C29
  Top 0.254: C1.C29 19.05,17.78 20.32,19.05 41.91,19.05 C2.C29 44.45,17.78 45.72,19.05 67.31,19.05 C3.C29 69.85,17.78 71.12,19.05 92.71,19.05 C4.C29 95.25,17.78 96.52,19.05 118.11,19.05 C5.C29 120.65,17.78 121.92,19.05 143.51,19.05 C6.C29 146.05,17.78 147.32,19.05 168.91,19.05 C7.C29 171.45,17.78 172.72,19.05 RN10.4 RN9.4
C30
  Top 0.254: C1.C30 19.05,15.24 20.32,16.51 41.91,16.51 C2.C30 44.45,15.24 45.72,16.51 67.31,16.51 C3.C30 69.85,15.24 71.12,16.51 92.71,16.51 C4.C30 95.25,15.24 96.52,16.51 118.11,16.51 C5.C30 120.65,15.24 121.92,16.51 143.51,16.51 C6.C30 146.05,15.24 147.32,16.51 168.91,16.51 C7.C30 171.45,15.24 172.72,16.51 RN10.3 RN9.3
C31
  Top 0.254: C1.C31 19.05,12.7 20.32,13.97 41.91,13.97 C2.C31 44.45,12.7 45.72,13.97 67.31,13.97 C3.C31 69.85,12.7 71.12,13.97 92.71,13.97 C4.C31 95.25,12.7 96.52,13.97 118.11,13.97 C5.C31 120.65,12.7 121.92,13.97 143.51,13.97 C6.C31 146.05,12.7 147.32,13.97 168.91,13.97 C7.C31 171.45,12.7 172.72,13.97 RN10.2 RN9.2
GND
  pour Bottom (isolate 0.305): 0,0 0,99.06 204.47,99.06 204.47,0
N$1  (via drill 2.8)
  other vias: 3.81,95.25
N$2  (via drill 2.8)
  other vias: 200.66,95.25
N$3  (via drill 2.8)
  other vias: 200.66,3.81
N$4  (via drill 2.8)
  other vias: 3.81,3.81
VCC
  pour Top (isolate 0.305): 0,7.62 0,91.44 7.62,91.44 7.62,99.06 196.85,99.06 196.85,91.44 204.47,91.44 204.47,7.62 196.85,7.62 196.85,0 7.62,0 7.62,7.62

### Text on the board
tNames: CS/A65 Backplane V1.1 / (C) S.Aguayo | GND | Board 1 | Board 2 | Board 3 | Board 4 | Board 5 | Board 6 | Board 7